# Altium schematic sheet 0234_GPU GDDR DEVICE M4.SchDoc
size 848 x 558 mm
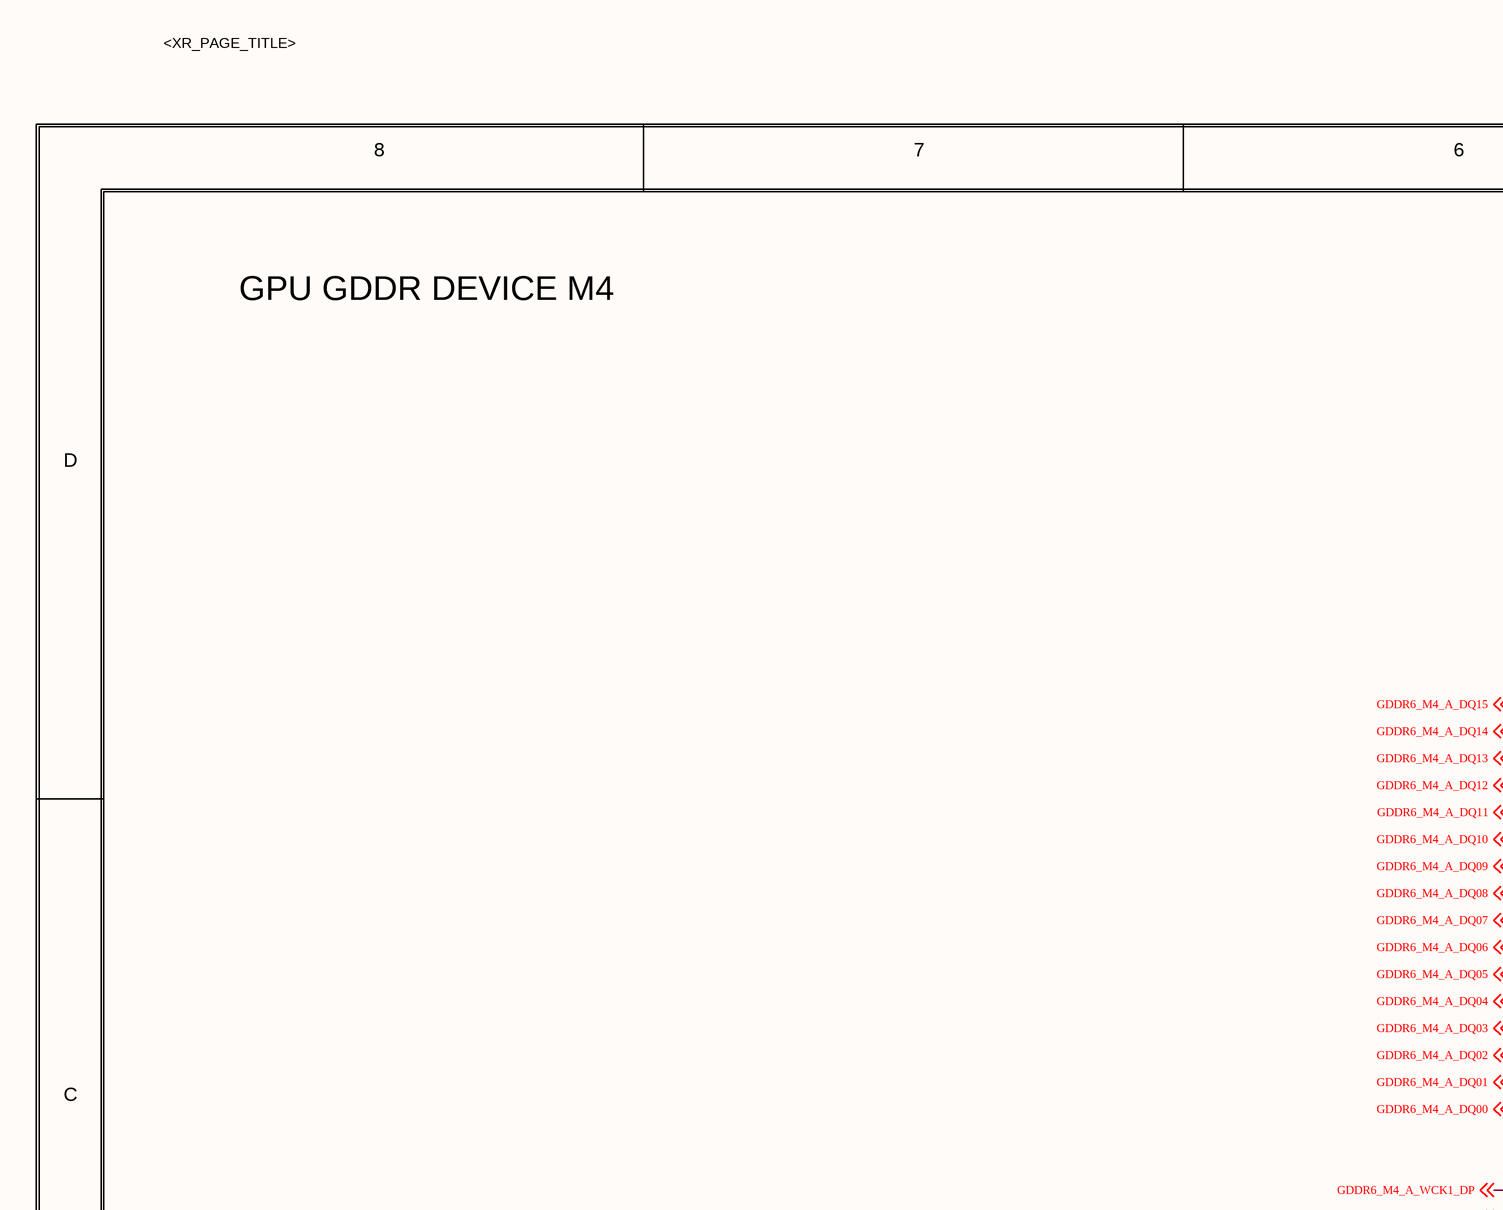
[diagram p0: 0234_GPU GDDR DEVICE M4.SchDoc, top left]
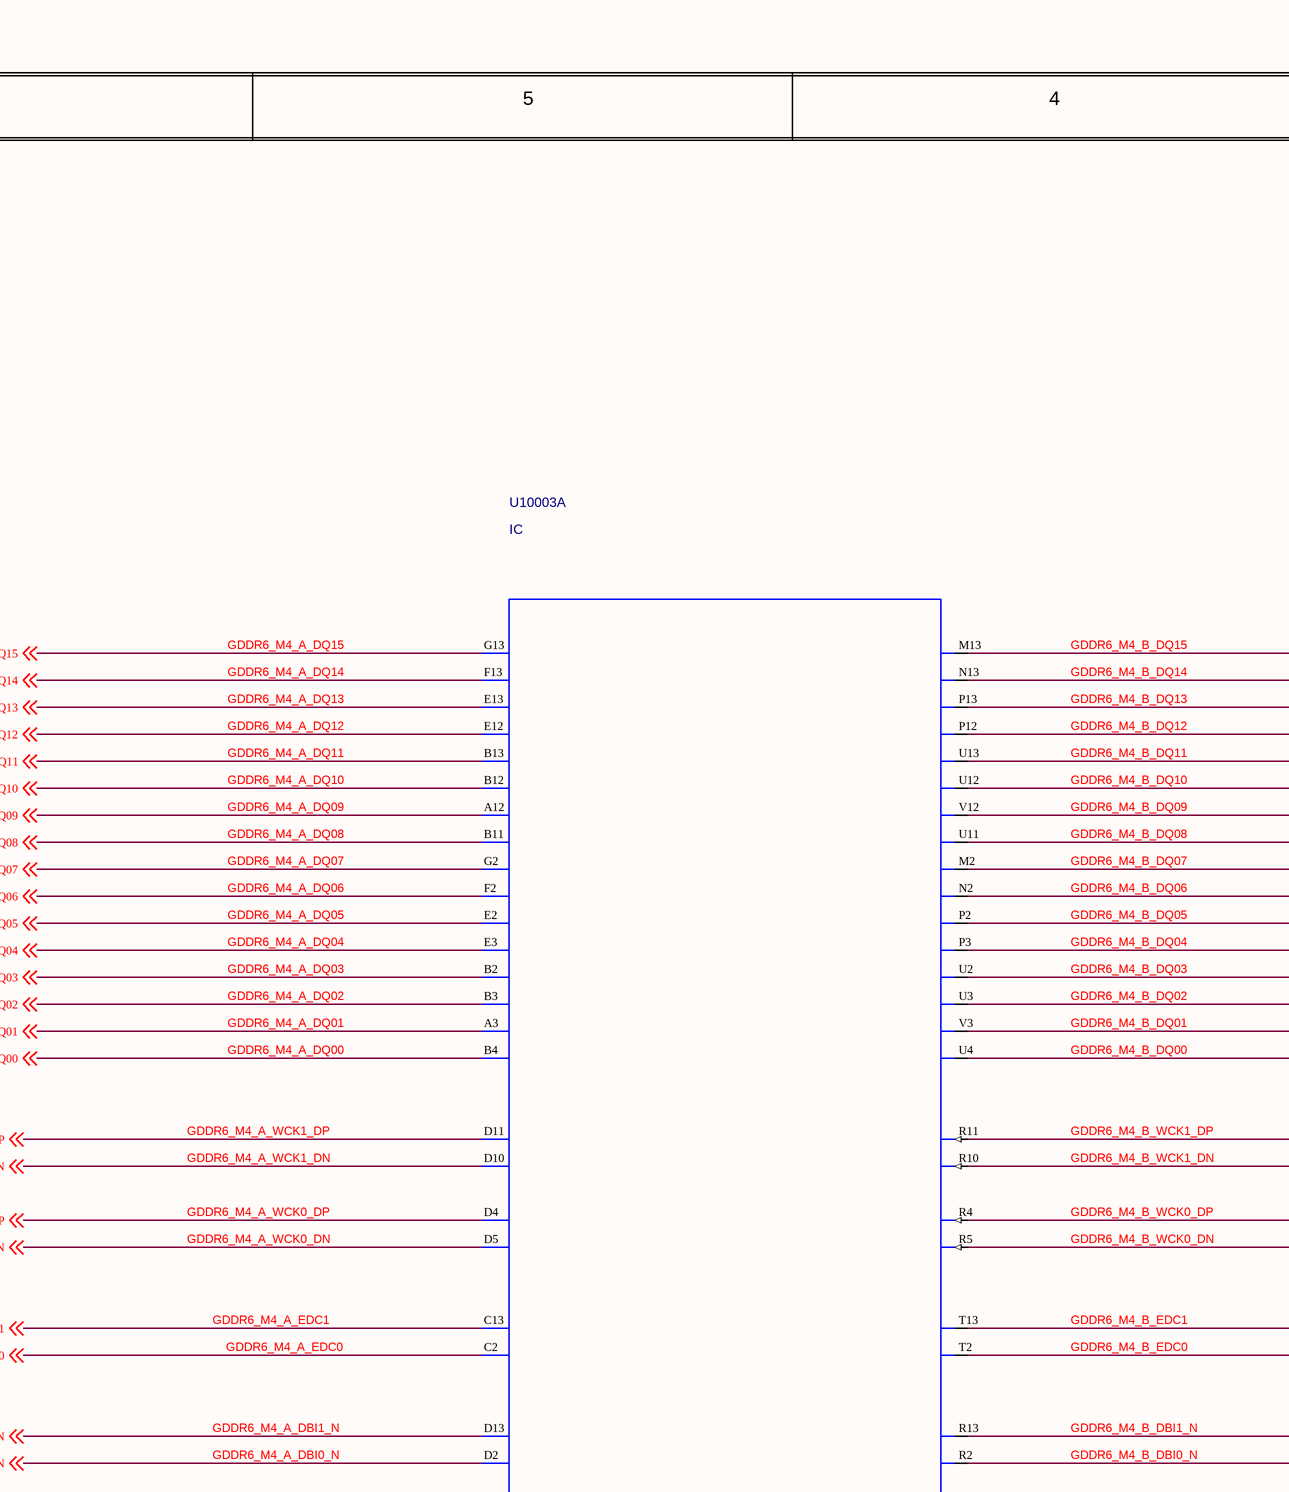
[diagram p1: 0234_GPU GDDR DEVICE M4.SchDoc, top middle]
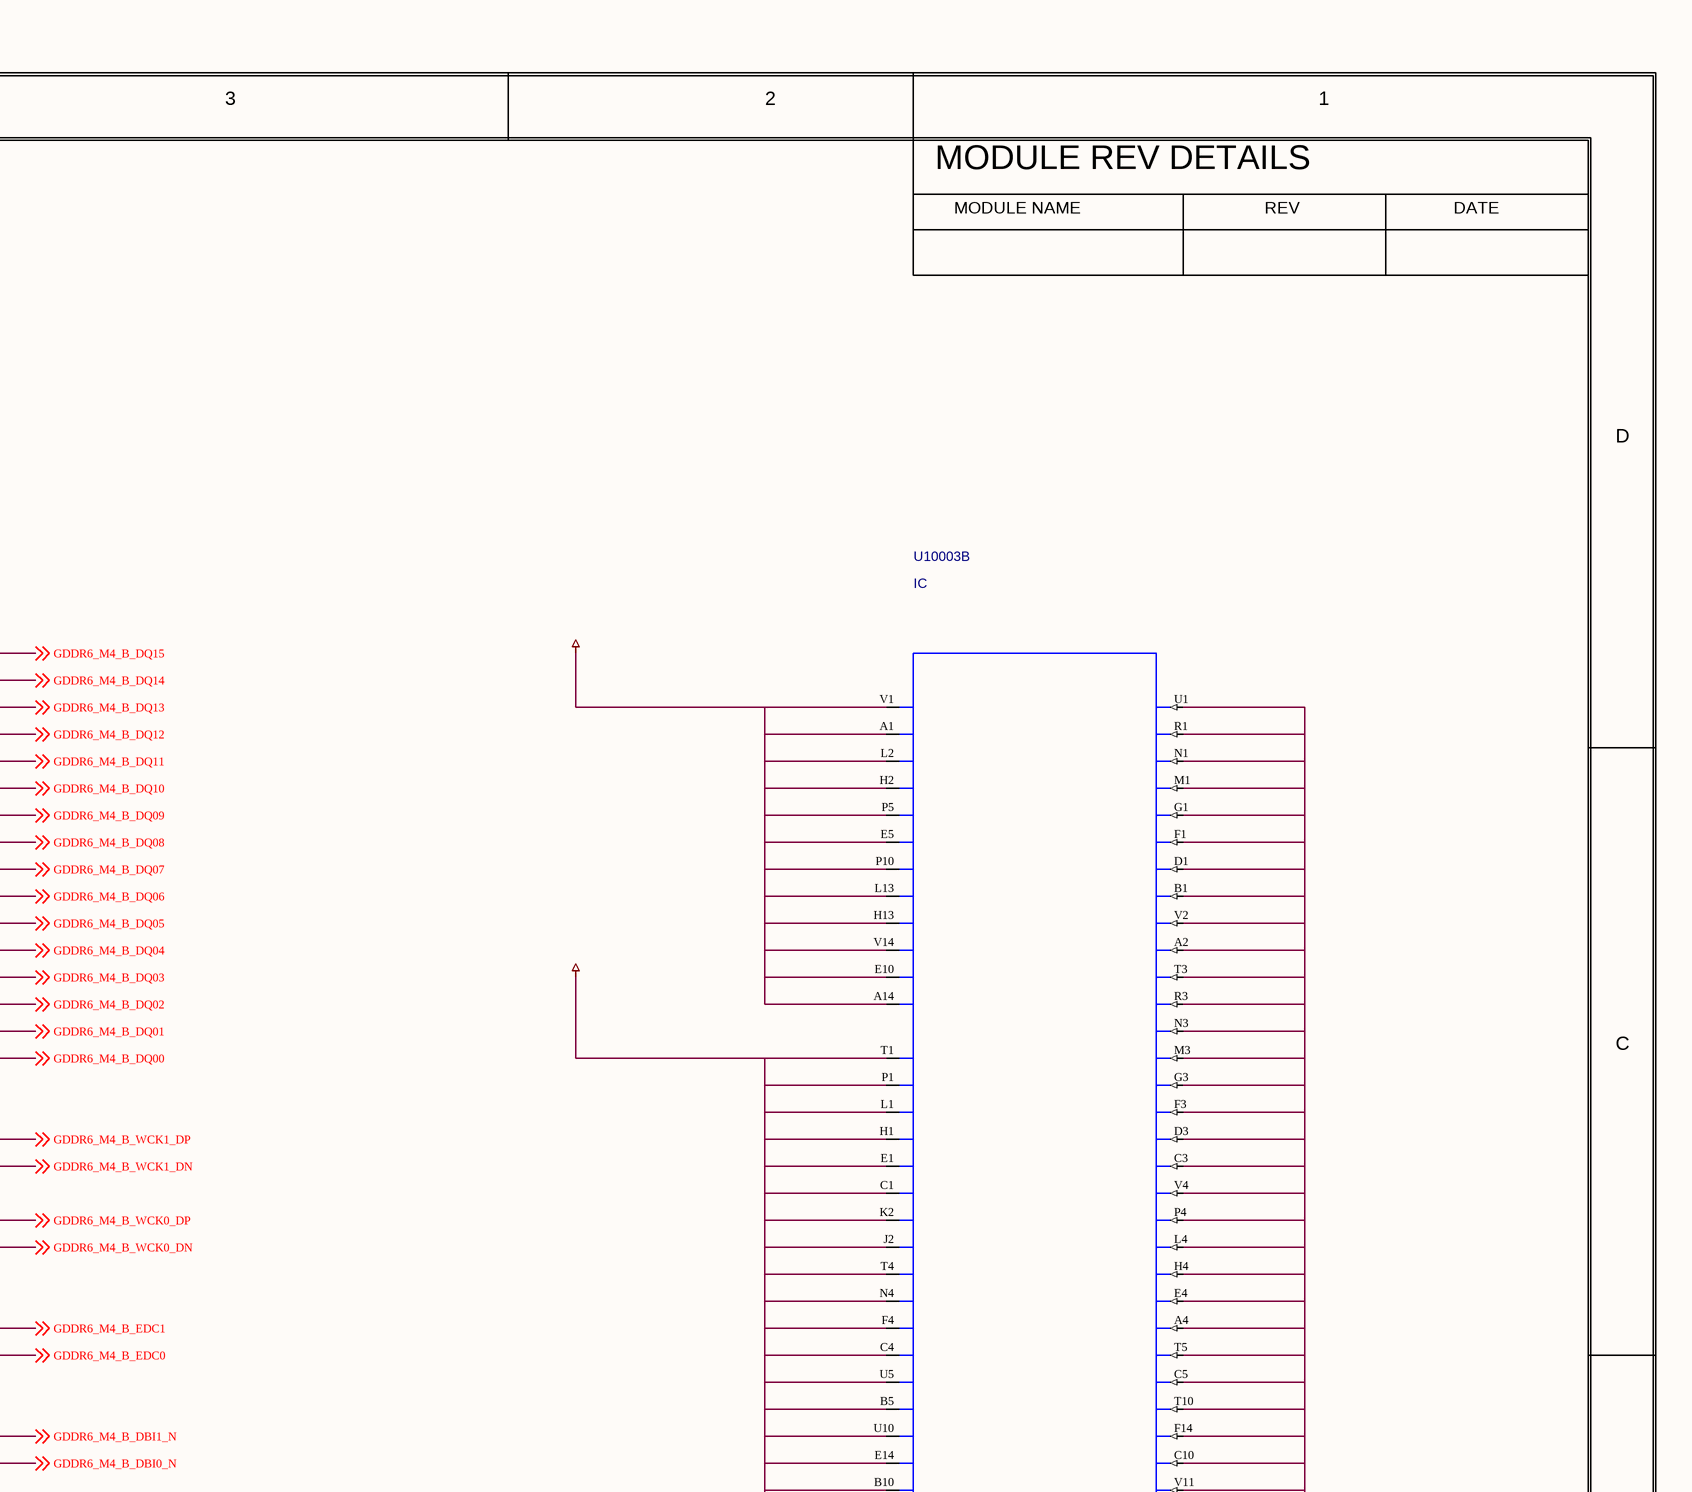
[diagram p2: 0234_GPU GDDR DEVICE M4.SchDoc, top right]
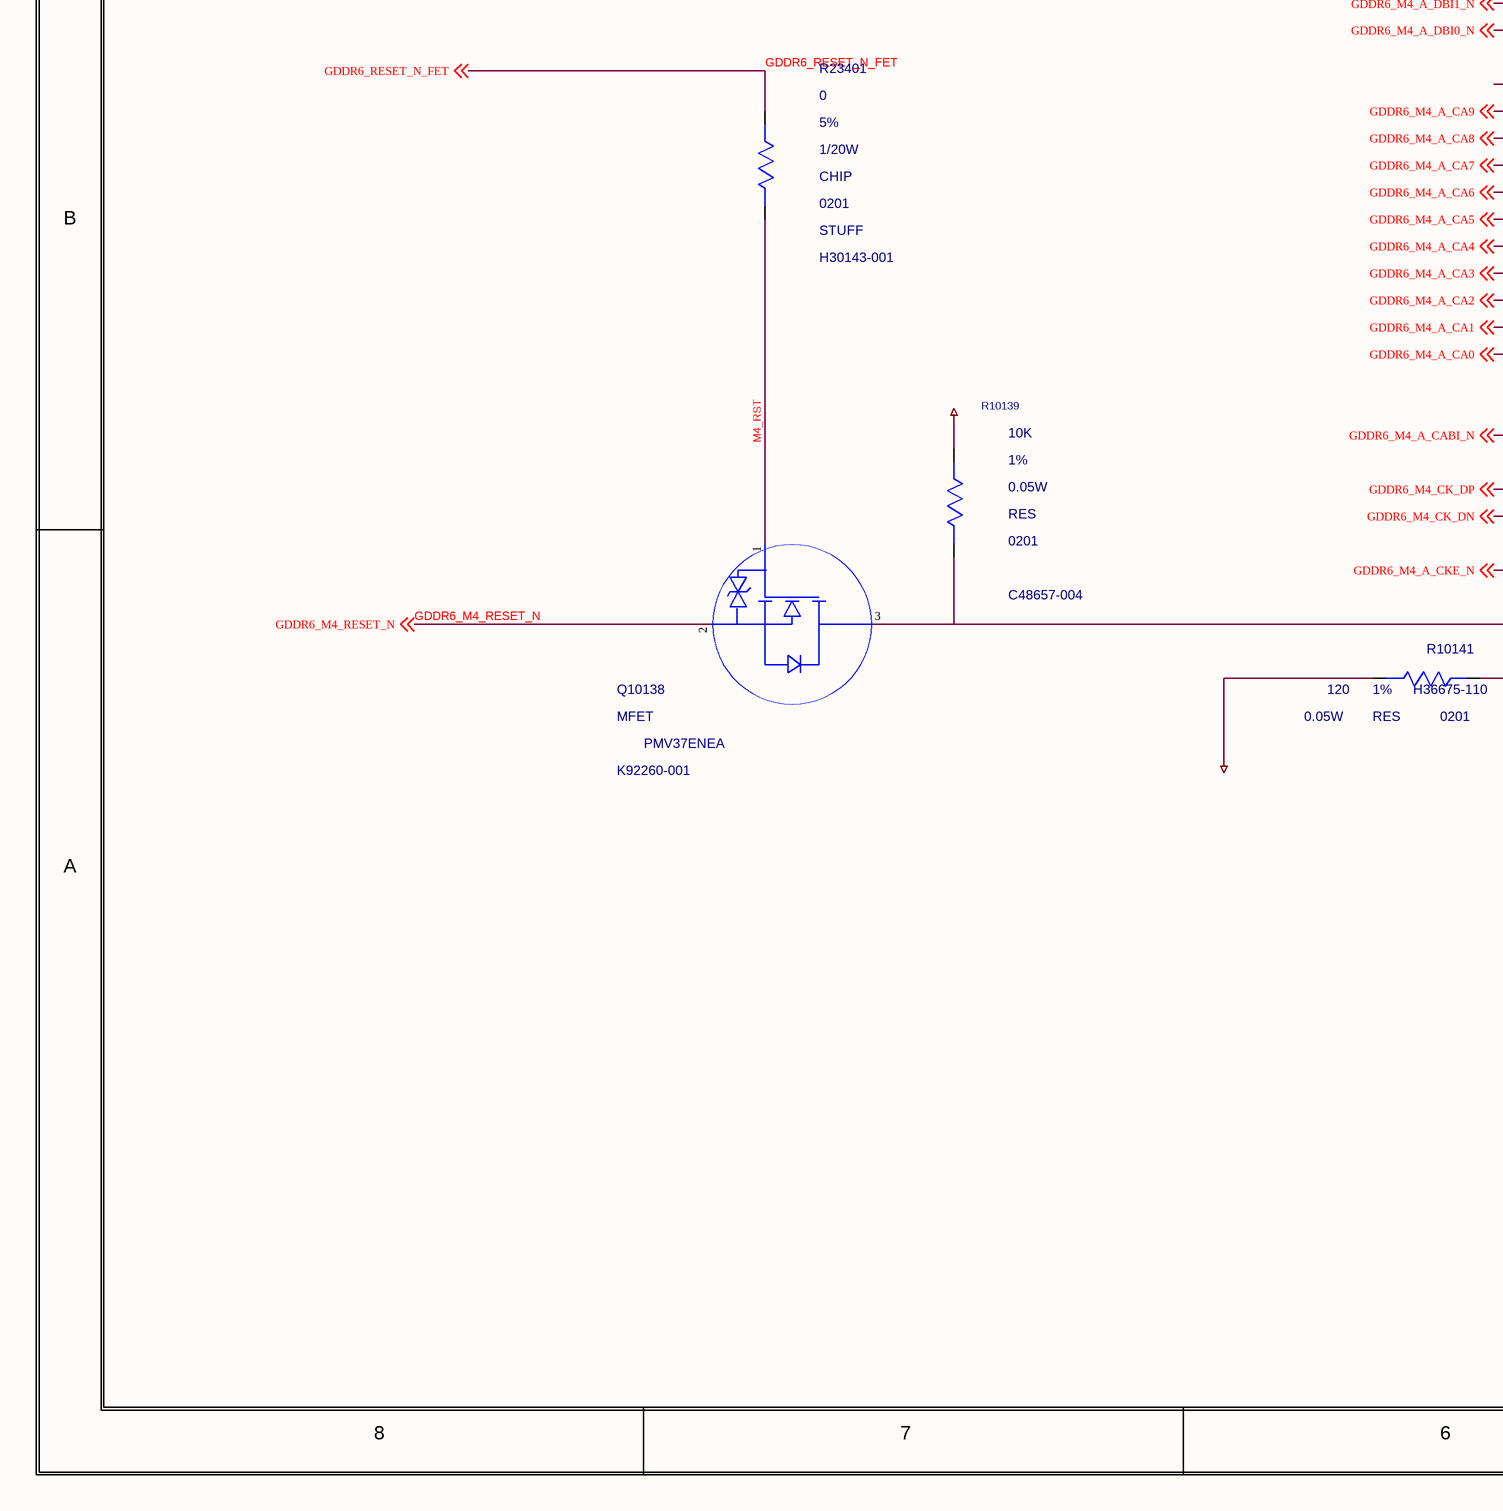
[diagram p3: 0234_GPU GDDR DEVICE M4.SchDoc, bottom left]
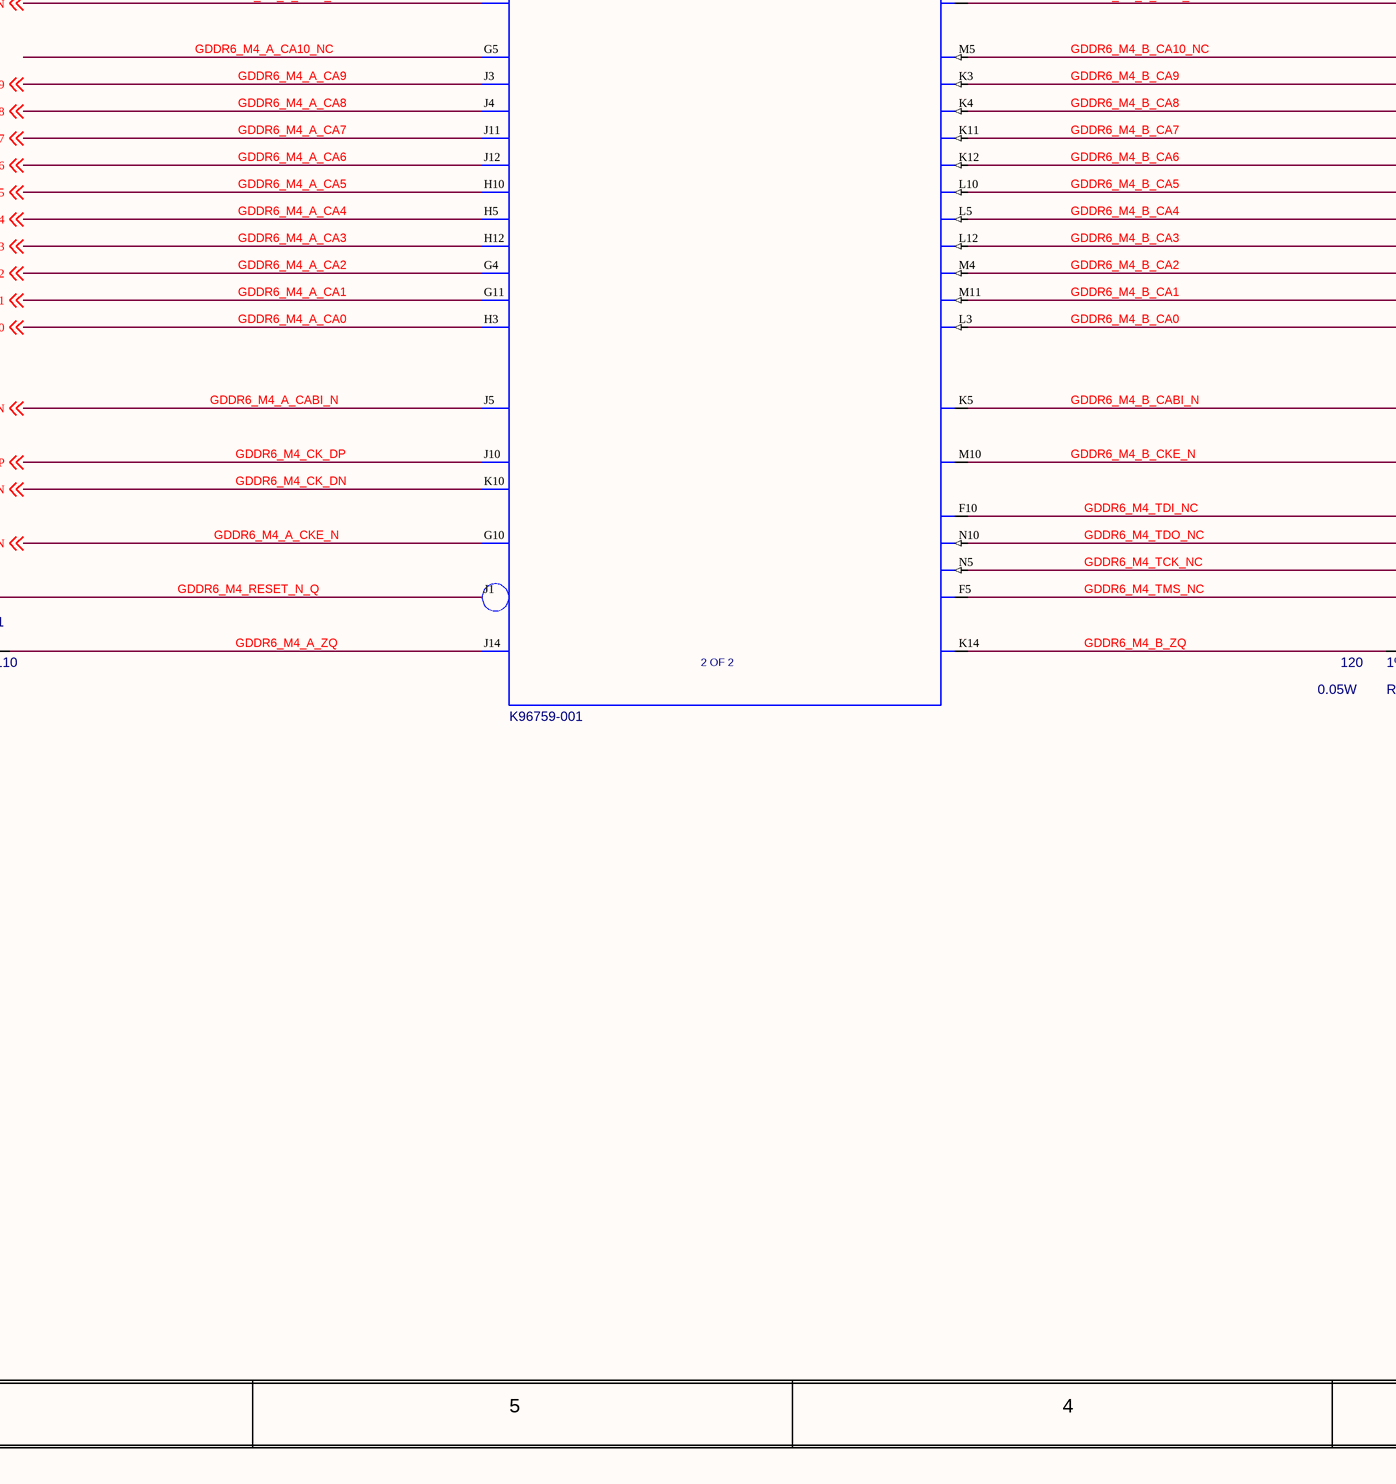
[diagram p4: 0234_GPU GDDR DEVICE M4.SchDoc, bottom middle]
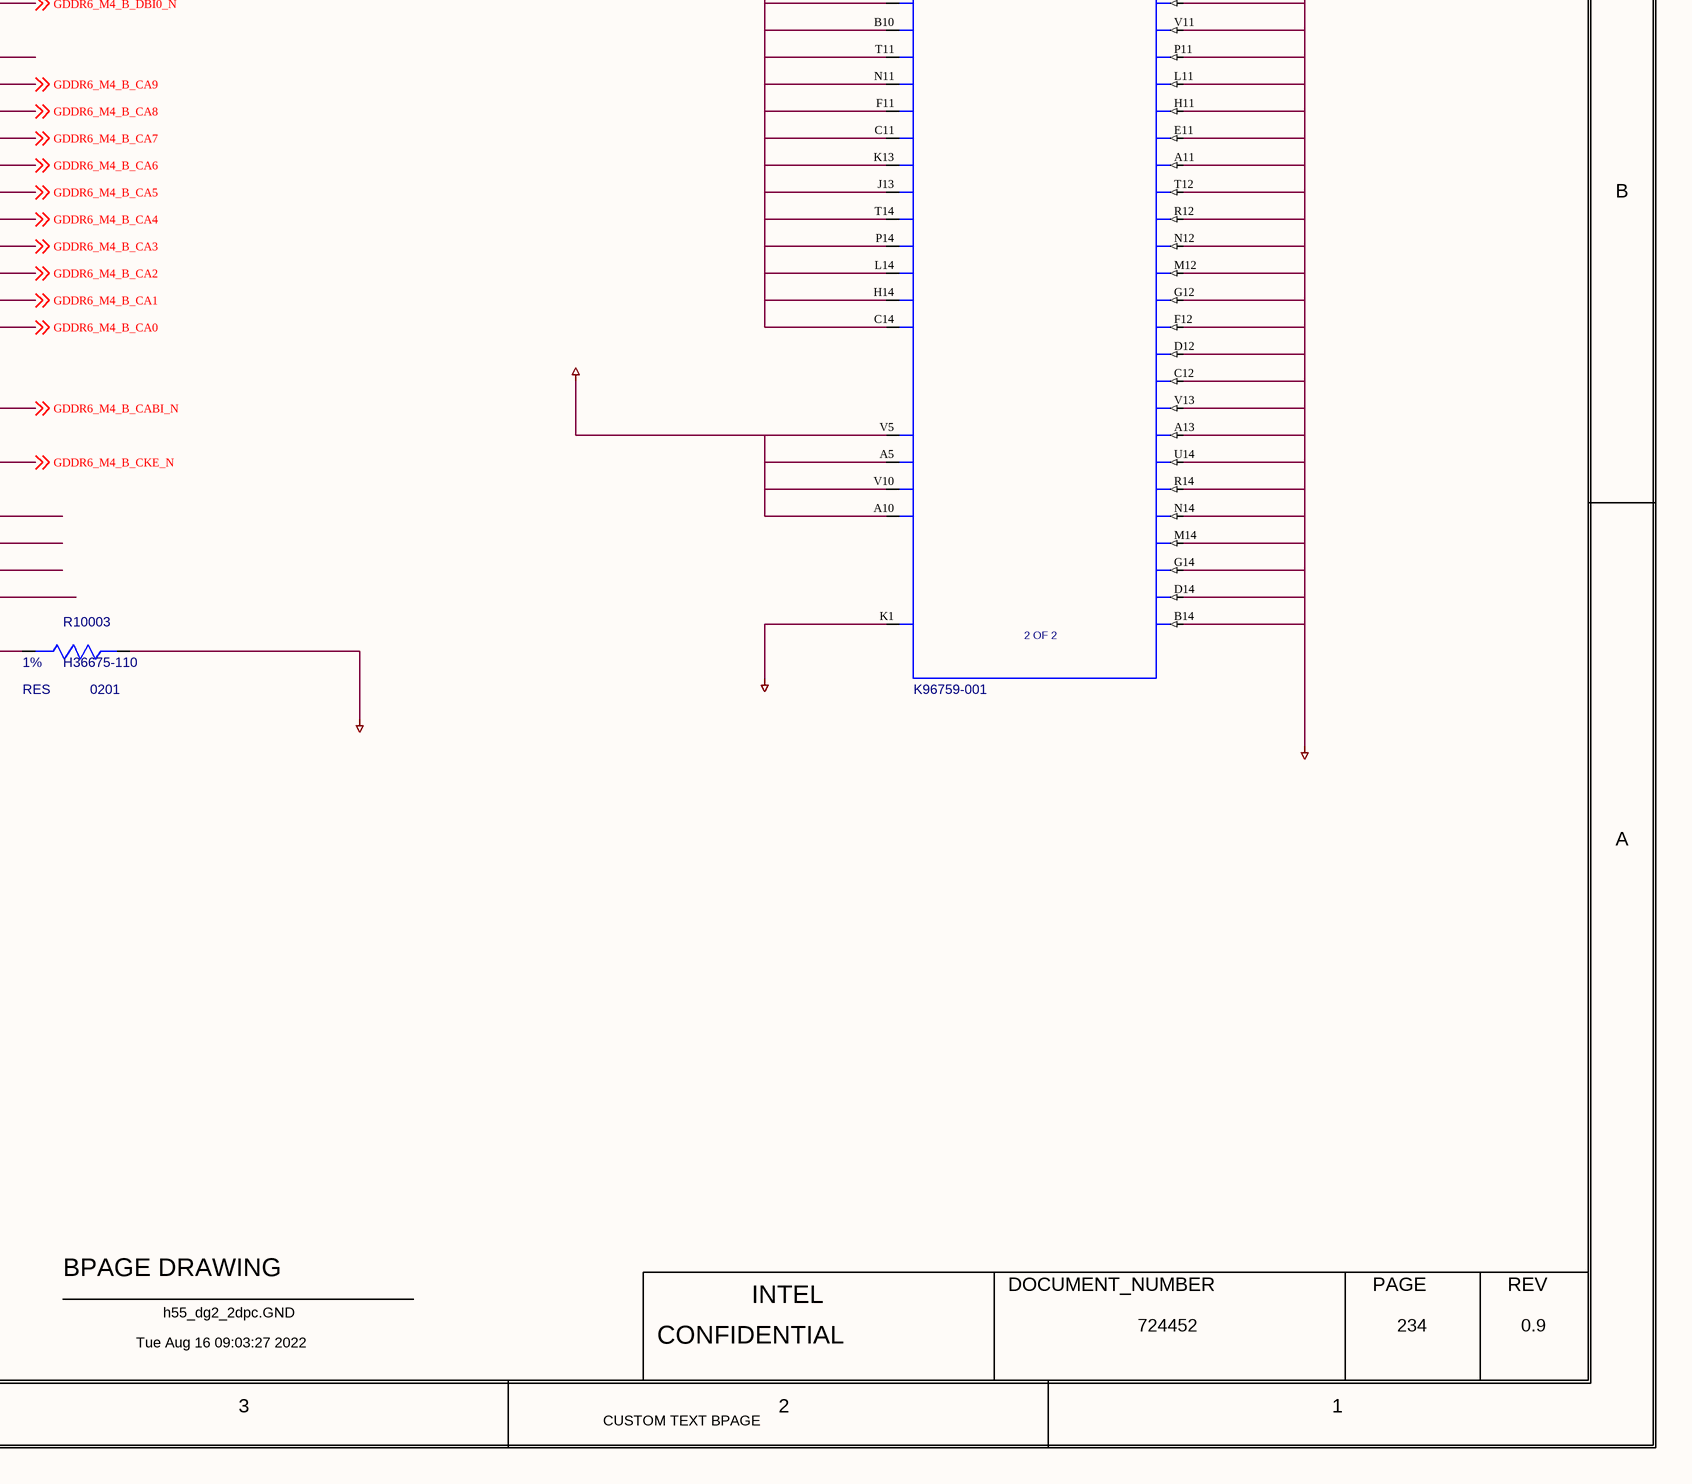
[diagram p5: 0234_GPU GDDR DEVICE M4.SchDoc, bottom right]

## Parts
Q10138  PMV37ENEA  MATERIAL: MFET  PART_NUMBER: K92260-001  [CTK2_SOT23_1400X3000_950_MA]
R10003  120  MATERIAL: RES  PACK_TYPE: 0201  PART_NUMBER: H36675-110  TOLERANCE: 1%  WATTAGE: 0.05W  [TK0_SM0201_630X330_MC]
R10139  10K  MATERIAL: RES  PACK_TYPE: 0201  PART_NUMBER: C48657-004  TOLERANCE: 1%  WATTAGE: 0.05W  [TK0_SM0201_630X330_MC]
R10141  120  MATERIAL: RES  PACK_TYPE: 0201  PART_NUMBER: H36675-110  TOLERANCE: 1%  WATTAGE: 0.05W  [TK0_SM0201_630X330_MC]
R23401  0  BOM_USE: STUFF  MATERIAL: CHIP  PACK_TYPE: 0201  PART_NUMBER: H30143-001  TOLERANCE: 5%  WATTAGE: 1/20W  [TK2_SM0201_630X330_MA]
U10003  MATERIAL: IC  PART_NUMBER: K96759-001  PART_SYM_NUM: 2 OF 2  [CTK0_BGA180_12100X14100_6_750_MA]  (hidden comment: C_GDDR6_16GB_180P)  (parts A,B of 2)

## Nets
+V1P8S_GPU: U10003.A5(VPP_02) U10003.A10(VPP_04) U10003.V5(VPP_01) U10003.V10(VPP_03)
+VDD_GDDR6: R10139.1(A) U10003.A1(VDD_02) U10003.A14(VDD_12) U10003.E5(VDD_06) U10003.E10(VDD_11) U10003.H2(VDD_04) U10003.H13(VDD_09) U10003.L2(VDD_03) U10003.L13(VDD_08) U10003.P5(VDD_05) U10003.P10(VDD_07) U10003.V1(VDD_01) U10003.V14(VDD_10)
+VDDQ_GPU: U10003.B5(VDDQ_14) U10003.B10(VDDQ_17) U10003.C1(VDDQ_06) U10003.C4(VDDQ_12) U10003.C11(VDDQ_21) U10003.C14(VDDQ_28) U10003.E1(VDDQ_05) U10003.E14(VDDQ_16) U10003.F4(VDDQ_11) U10003.F11(VDDQ_20) U10003.H1(VDDQ_04) U10003.H14(VDDQ_27) U10003.J2(VDDQ_08) U10003.J13(VDDQ_23) U10003.K2(VDDQ_07) U10003.K13(VDDQ_22) U10003.L1(VDDQ_03) U10003.L14(VDDQ_26) U10003.N4(VDDQ_10) U10003.N11(VDDQ_19) U10003.P1(VDDQ_02) U10003.P14(VDDQ_25) U10003.T1(VDDQ_01) U10003.T4(VDDQ_09) U10003.T11(VDDQ_18) U10003.T14(VDDQ_24) U10003.U5(VDDQ_13) U10003.U10(VDDQ_15)
GND: R10003.2(B) R10141.1(A) U10003.A2(VSS_10) U10003.A4(VSS_24) U10003.A11(VSS_35) U10003.A13(VSS_45) U10003.B1(VSS_08) U10003.B14(VSS_52) U10003.C3(VSS_18) U10003.C5(VSS_26) U10003.C10(VSS_29) U10003.C12(VSS_43) U10003.D1(VSS_07) U10003.D3(VSS_17) U10003.D12(VSS_42) U10003.D14(VSS_51) U10003.E4(VSS_23) U10003.E11(VSS_34) U10003.F1(VSS_06) U10003.F3(VSS_16) U10003.F12(VSS_41) U10003.F14(VSS_28) U10003.G1(VSS_05) U10003.G3(VSS_15) U10003.G12(VSS_40) U10003.G14(VSS_50) U10003.H4(VSS_22) U10003.H11(VSS_33) U10003.K1(VREFC) U10003.L4(VSS_21) U10003.L11(VSS_32) U10003.M1(VSS_04) U10003.M3(VSS_14) U10003.M12(VSS_39) U10003.M14(VSS_49) U10003.N1(VSS_03) U10003.N3(VSS_13) U10003.N12(VSS_38) U10003.N14(VSS_48) U10003.P4(VSS_20) U10003.P11(VSS_31) U10003.R1(VSS_02) U10003.R3(VSS_12) U10003.R12(VSS_37) U10003.R14(VSS_47) U10003.T3(VSS_11) U10003.T5(VSS_25) U10003.T10(VSS_27) U10003.T12(VSS_36) U10003.U1(VSS_01) U10003.U14(VSS_46) U10003.V2(VSS_09) U10003.V4(VSS_19) U10003.V11(VSS_30) U10003.V13(VSS_44)
GDDR6_M4_A_CA0: U10003.H3(CA0_A) ; off-sheet GDDR6_M4_A_CA0
GDDR6_M4_A_CA1: U10003.G11(CA1_A) ; off-sheet GDDR6_M4_A_CA1
GDDR6_M4_A_CA2: U10003.G4(CA2_A) ; off-sheet GDDR6_M4_A_CA2
GDDR6_M4_A_CA3: U10003.H12(CA3_A) ; off-sheet GDDR6_M4_A_CA3
GDDR6_M4_A_CA4: U10003.H5(CA4_A) ; off-sheet GDDR6_M4_A_CA4
GDDR6_M4_A_CA5: U10003.H10(CA5_A) ; off-sheet GDDR6_M4_A_CA5
GDDR6_M4_A_CA6: U10003.J12(CA6_A) ; off-sheet GDDR6_M4_A_CA6
GDDR6_M4_A_CA7: U10003.J11(CA7_A) ; off-sheet GDDR6_M4_A_CA7
GDDR6_M4_A_CA8: U10003.J4(CA8_A) ; off-sheet GDDR6_M4_A_CA8
GDDR6_M4_A_CA9: U10003.J3(CA9_A) ; off-sheet GDDR6_M4_A_CA9
GDDR6_M4_A_CA10_NC: U10003.G5(CA10_A_NC)
GDDR6_M4_A_CABI_N: U10003.J5(CABI_N_A) ; off-sheet GDDR6_M4_A_CABI_N
GDDR6_M4_A_CKE_N: U10003.G10(CKE_N_A) ; off-sheet GDDR6_M4_A_CKE_N
GDDR6_M4_A_DBI0_N: U10003.D2(DBI0_N_A) ; off-sheet GDDR6_M4_A_DBI0_N
GDDR6_M4_A_DBI1_N: U10003.D13(DBI1_N_A) ; off-sheet GDDR6_M4_A_DBI1_N
GDDR6_M4_A_DQ00: U10003.B4(DQ00_A) ; off-sheet GDDR6_M4_A_DQ00
GDDR6_M4_A_DQ01: U10003.A3(DQ01_A) ; off-sheet GDDR6_M4_A_DQ01
GDDR6_M4_A_DQ02: U10003.B3(DQ02_A) ; off-sheet GDDR6_M4_A_DQ02
GDDR6_M4_A_DQ03: U10003.B2(DQ03_A) ; off-sheet GDDR6_M4_A_DQ03
GDDR6_M4_A_DQ04: U10003.E3(DQ04_A) ; off-sheet GDDR6_M4_A_DQ04
GDDR6_M4_A_DQ05: U10003.E2(DQ05_A) ; off-sheet GDDR6_M4_A_DQ05
GDDR6_M4_A_DQ06: U10003.F2(DQ06_A) ; off-sheet GDDR6_M4_A_DQ06
GDDR6_M4_A_DQ07: U10003.G2(DQ07_A) ; off-sheet GDDR6_M4_A_DQ07
GDDR6_M4_A_DQ08: U10003.B11(DQ08_A) ; off-sheet GDDR6_M4_A_DQ08
GDDR6_M4_A_DQ09: U10003.A12(DQ09_A) ; off-sheet GDDR6_M4_A_DQ09
GDDR6_M4_A_DQ10: U10003.B12(DQ10_A) ; off-sheet GDDR6_M4_A_DQ10
GDDR6_M4_A_DQ11: U10003.B13(DQ11_A) ; off-sheet GDDR6_M4_A_DQ11
GDDR6_M4_A_DQ12: U10003.E12(DQ12_A) ; off-sheet GDDR6_M4_A_DQ12
GDDR6_M4_A_DQ13: U10003.E13(DQ13_A) ; off-sheet GDDR6_M4_A_DQ13
GDDR6_M4_A_DQ14: U10003.F13(DQ14_A) ; off-sheet GDDR6_M4_A_DQ14
GDDR6_M4_A_DQ15: U10003.G13(DQ15_A) ; off-sheet GDDR6_M4_A_DQ15
GDDR6_M4_A_EDC0: U10003.C2(EDC0_A) ; off-sheet GDDR6_M4_A_EDC0
GDDR6_M4_A_EDC1: U10003.C13(EDC1_A) ; off-sheet GDDR6_M4_A_EDC1
GDDR6_M4_A_WCK0_DN: U10003.D5(WCK0_C_A) ; off-sheet GDDR6_M4_A_WCK0_DN
GDDR6_M4_A_WCK0_DP: U10003.D4(WCK0_T_A) ; off-sheet GDDR6_M4_A_WCK0_DP
GDDR6_M4_A_WCK1_DN: U10003.D10(WCK1_C_A) ; off-sheet GDDR6_M4_A_WCK1_DN
GDDR6_M4_A_WCK1_DP: U10003.D11(WCK1_T_A) ; off-sheet GDDR6_M4_A_WCK1_DP
GDDR6_M4_A_ZQ: R10141.2(B) U10003.J14(ZQ_A)
GDDR6_M4_B_CA0: U10003.L3(CA0_B) ; off-sheet GDDR6_M4_B_CA0
GDDR6_M4_B_CA1: U10003.M11(CA1_B) ; off-sheet GDDR6_M4_B_CA1
GDDR6_M4_B_CA2: U10003.M4(CA2_B) ; off-sheet GDDR6_M4_B_CA2
GDDR6_M4_B_CA3: U10003.L12(CA3_B) ; off-sheet GDDR6_M4_B_CA3
GDDR6_M4_B_CA4: U10003.L5(CA4_B) ; off-sheet GDDR6_M4_B_CA4
GDDR6_M4_B_CA5: U10003.L10(CA5_B) ; off-sheet GDDR6_M4_B_CA5
GDDR6_M4_B_CA6: U10003.K12(CA6_B) ; off-sheet GDDR6_M4_B_CA6
GDDR6_M4_B_CA7: U10003.K11(CA7_B) ; off-sheet GDDR6_M4_B_CA7
GDDR6_M4_B_CA8: U10003.K4(CA8_B) ; off-sheet GDDR6_M4_B_CA8
GDDR6_M4_B_CA9: U10003.K3(CA9_B) ; off-sheet GDDR6_M4_B_CA9
GDDR6_M4_B_CA10_NC: U10003.M5(CA10_B_NC)
GDDR6_M4_B_CABI_N: U10003.K5(CABI_N_B) ; off-sheet GDDR6_M4_B_CABI_N
GDDR6_M4_B_CKE_N: U10003.M10(CKE_N_B) ; off-sheet GDDR6_M4_B_CKE_N
GDDR6_M4_B_DBI0_N: U10003.R2(DBI0_N_B) ; off-sheet GDDR6_M4_B_DBI0_N
GDDR6_M4_B_DBI1_N: U10003.R13(DBI1_N_B) ; off-sheet GDDR6_M4_B_DBI1_N
GDDR6_M4_B_DQ00: U10003.U4(DQ00_B) ; off-sheet GDDR6_M4_B_DQ00
GDDR6_M4_B_DQ01: U10003.V3(DQ01_B) ; off-sheet GDDR6_M4_B_DQ01
GDDR6_M4_B_DQ02: U10003.U3(DQ02_B) ; off-sheet GDDR6_M4_B_DQ02
GDDR6_M4_B_DQ03: U10003.U2(DQ03_B) ; off-sheet GDDR6_M4_B_DQ03
GDDR6_M4_B_DQ04: U10003.P3(DQ04_B) ; off-sheet GDDR6_M4_B_DQ04
GDDR6_M4_B_DQ05: U10003.P2(DQ05_B) ; off-sheet GDDR6_M4_B_DQ05
GDDR6_M4_B_DQ06: U10003.N2(DQ06_B) ; off-sheet GDDR6_M4_B_DQ06
GDDR6_M4_B_DQ07: U10003.M2(DQ07_B) ; off-sheet GDDR6_M4_B_DQ07
GDDR6_M4_B_DQ08: U10003.U11(DQ08_B) ; off-sheet GDDR6_M4_B_DQ08
GDDR6_M4_B_DQ09: U10003.V12(DQ09_B) ; off-sheet GDDR6_M4_B_DQ09
GDDR6_M4_B_DQ10: U10003.U12(DQ10_B) ; off-sheet GDDR6_M4_B_DQ10
GDDR6_M4_B_DQ11: U10003.U13(DQ11_B) ; off-sheet GDDR6_M4_B_DQ11
GDDR6_M4_B_DQ12: U10003.P12(DQ12_B) ; off-sheet GDDR6_M4_B_DQ12
GDDR6_M4_B_DQ13: U10003.P13(DQ13_B) ; off-sheet GDDR6_M4_B_DQ13
GDDR6_M4_B_DQ14: U10003.N13(DQ14_B) ; off-sheet GDDR6_M4_B_DQ14
GDDR6_M4_B_DQ15: U10003.M13(DQ15_B) ; off-sheet GDDR6_M4_B_DQ15
GDDR6_M4_B_EDC0: U10003.T2(EDC0_B) ; off-sheet GDDR6_M4_B_EDC0
GDDR6_M4_B_EDC1: U10003.T13(EDC1_B) ; off-sheet GDDR6_M4_B_EDC1
GDDR6_M4_B_WCK0_DN: U10003.R5(WCK0_C_B) ; off-sheet GDDR6_M4_B_WCK0_DN
GDDR6_M4_B_WCK0_DP: U10003.R4(WCK0_T_B) ; off-sheet GDDR6_M4_B_WCK0_DP
GDDR6_M4_B_WCK1_DN: U10003.R10(WCK1_C_B) ; off-sheet GDDR6_M4_B_WCK1_DN
GDDR6_M4_B_WCK1_DP: U10003.R11(WCK1_T_B) ; off-sheet GDDR6_M4_B_WCK1_DP
GDDR6_M4_B_ZQ: R10003.1(A) U10003.K14(ZQ_B)
GDDR6_M4_CK_DN: U10003.K10(CK_C) ; off-sheet GDDR6_M4_CK_DN
GDDR6_M4_CK_DP: U10003.J10(CK_T) ; off-sheet GDDR6_M4_CK_DP
GDDR6_M4_RESET_N: Q10138.2(S) ; off-sheet GDDR6_M4_RESET_N
GDDR6_M4_RESET_N_Q: Q10138.3(D) R10139.2(B) U10003.J1(RESET_N)
GDDR6_M4_TCK_NC: U10003.N5(TCK)
GDDR6_M4_TDI_NC: U10003.F10(TDI)
GDDR6_M4_TDO_NC: U10003.N10(TDO)
GDDR6_M4_TMS_NC: U10003.F5(TMS)
GDDR6_RESET_N_FET: R23401.1(A) ; off-sheet GDDR6_RESET_N_FET
M4_RST: Q10138.1(G) R23401.2(B)

## Notes on the sheet
- <XR_PAGE_TITLE>
- 8
- 7
- 6
- 5
- 4
- 3
- 2
- 1
- MODULE REV DETAILS
- GPU GDDR DEVICE M4
- MODULE NAME
- REV
- DATE
- D
- C
- B
- A
- BPAGE DRAWING
- INTEL
- DOCUMENT_NUMBER
- PAGE
- Tue Aug 16 09:03:27 2022
- h55_dg2_2dpc.GND
- CONFIDENTIAL
- 724452
- 234
- 0.9
- CUSTOM TEXT BPAGE

## Library data of the parts
Q10138 = C_MOSFET_N_ESD: CDS_PHYS_PART_NAME: C_MOSFET_N_ESD_SOT23-K92260-001,MFET,PMV37ENEA,TK2,GENERIC; CDS_LMAN_SYM_OUTLINE: -150,150,150,-150; FP_TECH: TK2; IP: GENERIC; PACK_TYPE: SOT23; ROOM: NONE; OriginalSymbolOrigin: (-150,150); XY: (-6725,1450); VER: 1; ROT: 5; PHYS_PAGE: 234; LOCATION: Q10138; DRAWING: @RVP1_ADL_SB_ADP_S_DDR5_SODIMM_2DPC_LIB.H55_DG2_2DPC(SCH_1):PAGE405; CDS_LIB: local; VARIANT: ?; PCB Footprint: CTK2_SOT23_1400X3000_950_MA; CHIPS_PART_NAME: C_MOSFET_N_ESD; CDS_PART_NAME: C_MOSFET_N_ESD_SOT23-K92260-001,MFET,PMV37ENEA,TK2,GENERIC; CDS_LOCATION: Q10138
R10003 = RES_2#1: CHIPS_PART_NAME: RES_2; CDS_PHYS_PART_NAME: RES_2_0201-H36675-110,RES,120,1%,0.05W,TK0,GENERIC; BOM_USE: STUFF; CDS_LMAN_SYM_OUTLINE: -50,50,50,-50; FP_TECH: TK0; IP: GENERIC; ROOM: NONE; OriginalSymbolOrigin: (-75,25); XY: (-2800,1350); VER: 1; ROT: 0; PHYS_PAGE: 234; LOCATION: R10003; DRAWING: @RVP1_ADL_SB_ADP_S_DDR5_SODIMM_2DPC_LIB.H55_DG2_2DPC(SCH_1):PAGE405; CDS_LIB: discrete_2; VARIANT: ?; PCB Footprint: TK0_SM0201_630X330_MC; CDS_PART_NAME: RES_2_0201-H36675-110,RES,120,1%,0.05W,TK0,GENERIC; CDS_LOCATION: R10003
R10139 = RES_2: CDS_PHYS_PART_NAME: RES_2_0201-C48657-004,RES,10K,1%,0.05W,TK0,GENERIC; BOM_USE: STUFF; CDS_LMAN_SYM_OUTLINE: -50,50,50,-50; FP_TECH: TK0; IP: GENERIC; ROOM: NONE; OriginalSymbolOrigin: (-25,75); XY: (-6425,1675); VER: 2; ROT: 0; PHYS_PAGE: 234; LOCATION: R10139; DRAWING: @RVP1_ADL_SB_ADP_S_DDR5_SODIMM_2DPC_LIB.H55_DG2_2DPC(SCH_1):PAGE405; CDS_LIB: discrete_2; VARIANT: ?; PCB Footprint: TK0_SM0201_630X330_MC; CHIPS_PART_NAME: RES_2; CDS_PART_NAME: RES_2_0201-C48657-004,RES,10K,1%,0.05W,TK0,GENERIC; CDS_LOCATION: R10139
R10141 = RES_2#1: CHIPS_PART_NAME: RES_2; CDS_PHYS_PART_NAME: RES_2_0201-H36675-110,RES,120,1%,0.05W,TK0,GENERIC; BOM_USE: STUFF; CDS_LMAN_SYM_OUTLINE: -50,50,50,-50; FP_TECH: TK0; IP: GENERIC; ROOM: NONE; OriginalSymbolOrigin: (-75,25); XY: (-5550,1350); VER: 1; ROT: 0; PHYS_PAGE: 234; LOCATION: R10141; DRAWING: @RVP1_ADL_SB_ADP_S_DDR5_SODIMM_2DPC_LIB.H55_DG2_2DPC(SCH_1):PAGE405; CDS_LIB: discrete_2; VARIANT: ?; PCB Footprint: TK0_SM0201_630X330_MC; CDS_PART_NAME: RES_2_0201-H36675-110,RES,120,1%,0.05W,TK0,GENERIC; CDS_LOCATION: R10141
R23401 = RES_2: CDS_PHYS_PART_NAME: RES_2_0201-H30143-001,CHIP,0,5%,1/20W,TK2,GENERIC; CDS_LMAN_SYM_OUTLINE: -50,50,50,-50; FP_TECH: TK2; IP: GENERIC; ROOM: NONE; OriginalSymbolOrigin: (-25,75); XY: (-6775,2300); VER: 2; PHYS_PAGE: 234; LOCATION: R23401; DRAWING: @RVP1_ADL_SB_ADP_S_DDR5_SODIMM_2DPC_LIB.H55_DG2_2DPC(SCH_1):PAGE405; CDS_LIB: discrete_2; VARIANT: ?; PCB Footprint: TK2_SM0201_630X330_MA; ROT: 0; CHIPS_PART_NAME: RES_2; CDS_PART_NAME: RES_2_0201-H30143-001,CHIP,0,5%,1/20W,TK2,GENERIC; CDS_LOCATION: R23401
U10003 = C_GDDR6_16GB_180P: CDS_PHYS_PART_NAME: C_GDDR6_16GB_180P_BGA-K96759-001,IC,GDDR6_16GB_180P,TK0,GENERIC; CDS_LMAN_SYM_OUTLINE: -250,1400,200,-1350; FP_TECH: TK0; IP: GENERIC; PACK_TYPE: BGA; ROOM: NONE; OriginalSymbolOrigin: (-275,1400); CaptureCellPackProp: C_GDDR6_16GB_180PA; XY: (-4125,2700); VER: 1; ROT: 0; PHYS_PAGE: 234; LOCATION: U10003; DRAWING: @RVP1_ADL_SB_ADP_S_DDR5_SODIMM_2DPC_LIB.H55_DG2_2DPC(SCH_1):PAGE405; CDS_LIB: local; VARIANT: ?; PCB Footprint: CTK0_BGA180_12100X14100_6_750_MA; CHIPS_PART_NAME: C_GDDR6_16GB_180P; CDS_PART_NAME: C_GDDR6_16GB_180P_BGA-K96759-001,IC,GDDR6_16GB_180P,TK0,GENERIC; CDS_LOCATION: U10003